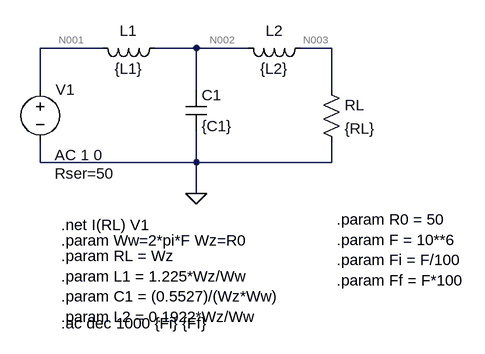
[diagram p0: schematic Ej DESNORMALIZADO.asc]
Ej DESNORMALIZADO.asc, the LTspice schematic file:
Version 4
SHEET 1 880 680
WIRE 176 48 80 48
WIRE 320 48 256 48
WIRE 400 48 320 48
WIRE 528 48 480 48
WIRE 80 112 80 48
WIRE 320 112 320 48
WIRE 528 112 528 48
WIRE 80 224 80 192
WIRE 320 224 320 176
WIRE 320 224 80 224
WIRE 528 224 528 192
WIRE 528 224 320 224
WIRE 320 272 320 224
FLAG 320 272 0
SYMBOL voltage 80 96 R0
WINDOW 123 22 117 Left 2
WINDOW 39 22 145 Left 2
SYMATTR InstName V1
SYMATTR Value ""
SYMATTR Value2 AC 1 0
SYMATTR SpiceLine Rser=50
SYMBOL ind 272 32 R90
WINDOW 0 5 56 VBottom 2
WINDOW 3 32 56 VTop 2
SYMATTR InstName L1
SYMATTR Value {L1}
SYMBOL cap 304 112 R0
SYMATTR InstName C1
SYMATTR Value {C1}
SYMBOL ind 496 32 R90
WINDOW 0 5 56 VBottom 2
WINDOW 3 32 56 VTop 2
SYMATTR InstName L2
SYMATTR Value {L2}
SYMBOL res 512 96 R0
SYMATTR InstName RL
SYMATTR Value {RL}
TEXT 112 320 Left 2 !.net I(RL) V1
TEXT 112 344 Left 2 !.param Ww=2*pi*F Wz=R0
TEXT 112 368 Left 2 !.param RL = Wz\n.param L1 = 1.225*Wz/Ww\n.param C1 = (0.5527)/(Wz*Ww)\n.param L2 = 0.1922*Wz/Ww
TEXT 112 472 Left 2 !.ac dec 1000 {Fi} {Ff}
TEXT 536 312 Left 2 !.param R0 = 50\n.param F = 10**6\n.param Fi = F/100\n.param Ff = F*100

The netlist it stands for:
* Ej DESNORMALIZADO.asc
V1 N001 0 AC 1 0 Rser=50
L1 N002 N001 {L1}
C1 N002 0 {C1}
L2 N003 N002 {L2}
RL N003 0 {RL}
.net I(RL) V1
.param Ww=2*pi*F Wz=R0
.param RL = Wz
.param L1 = 1.225*Wz/Ww
.param C1 = (0.5527)/(Wz*Ww)
.param L2 = 0.1922*Wz/Ww
.ac dec 1000 {Fi} {Ff}
.param R0 = 50
.param F = 10**6
.param Fi = F/100
.param Ff = F*100
.backanno
.end

* Results of the author's LTspice run, read from the files saved beside the schematic
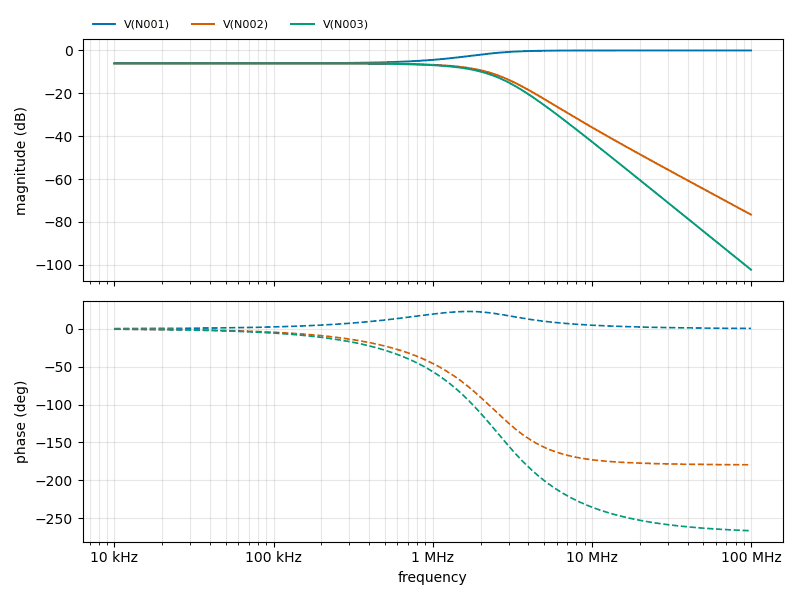
[diagram p1: AC Analysis of Ej DESNORMALIZADO.asc, plotted from the saved traces]
* AC Analysis, 1 run:
*   V(N001): -6.02 dB at 10 kHz, -0.00 dB at 100 MHz, peak -0.00 dB at 100 MHz, 3 dB below the peak at 1.541 MHz
*   V(N002): -6.02 dB at 10 kHz, -76.60 dB at 100 MHz, peak -6.02 dB at 10 kHz, 3 dB below the peak at 1.936 MHz
*   V(N003): -6.02 dB at 10 kHz, -102.29 dB at 100 MHz, peak -6.02 dB at 10 kHz, 3 dB below the peak at 1.792 MHz